# EAGLE design IRRemote (EAGLE 7.5.0)
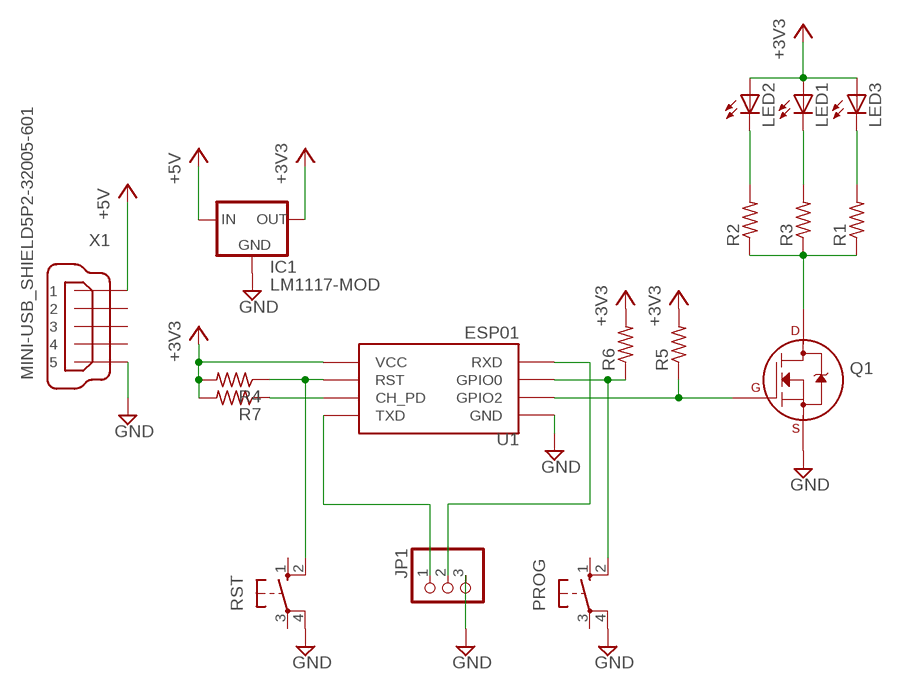
[diagram p0: schematic, sheet 1]

## Parts
IC1  LM1117-MOD  [TO220BV]
JP1  PINHD-1X3  [1X03]
LED1  LED5MM  [LED5MM]
LED2  LED5MM  [LED5MM]
LED3  LED5MM  [LED5MM]
PROG  10-XX  [B3F-10XX]
Q1  2N7000_TO92  [TO-92]
R1  R-US_0309/10  [0309/10]
R2  R-US_0309/10  [0309/10]
R3  R-US_0309/10  [0309/10]
R4  R-US_0309/10  [0309/10]
R5  R-US_0309/10  [0309/10]
R6  R-US_0309/10  [0309/10]
R7  R-US_0309/10  [0309/10]
RST  10-XX  [B3F-10XX]
U1  ESP01  [ESP01A]
X1  MINI-USB_SHIELD5P2-32005-601  [32005-601]

## Nets
+3V3: IC1.2(VOUT) LED1.A LED2.A LED3.A R4.2 R5.2 R6.2 R7.2 U1.VCC
+5V: IC1.3(VIN) X1.1
GND: IC1.1(GND) JP1.3 PROG.4(P1) Q1.1(S) RST.4(P1) U1.GND X1.5
N$1: Q1.3(D) R1.1 R2.1 R3.1
N$2: LED2.K(C) R2.2
N$3: LED1.K(C) R3.2
N$4: LED3.K(C) R1.2
N$5: Q1.2(G) R5.1 U1.GPIO2
N$8: R4.1 RST.2(S1) U1.RST
N$9: PROG.2(S1) R6.1 U1.GPIO0
N$11: R7.1 U1.CH_PD
RX: JP1.2 U1.RX(RXD)
TX: JP1.1 U1.TX(TXD)
Unconnected: PROG.1(S) PROG.3(P) RST.1(S) RST.3(P) X1.2 X1.3 X1.4 X1.M1(S1) X1.M2(S2)

## Library data of the parts
IC1 = bt_regulator:LM1117-MOD
JP1 = pinhead:PINHD-1X3: PIN HEADER
LED1-LED3 = led:LED: LED OSRAM: - CHIPLED LG R971, LG N971, LY N971, LG Q971, LY Q971, LO R971, LY R971 LH N974, LH R974 LS Q976, LO Q976, LY Q976 LO Q996 - Hyper CHIPLED LW Q18S LB Q993, LB Q99A, LB R99A - SideLED LS A670, LO A670, LY A670, LG A670, LP A670 LB A673, LV A673, LT A673, LW A673 LH A674 LY A675 LS A676, LA A676, LO A676, LY A676, LW A676 LS A679, LY A679, LG A679 - Hyper Micro SIDELED® LS Y876, LA Y876, LO Y876, LY Y876 LT Y87S - SmartLED LW L88C, LW L88S LB L89C, LB L89S, LG L890 LS L89K, LO L89K, LY L89K LS L896, LA L896, LO L896, LY L896 - TOPLED LS T670, LO T670, LY T670, LG T670, LP T670 LSG T670, LSP T670, LSY T670, LOP T670, LYG T670 LG T671, LOG T671, LSG T671 LB T673, LV T673, LT T673, LW T673 LH T674 LS T676, LA T676, LO T676, LY T676, LB T676, LH T676, LSB T676, LW T676 LB T67C, LV T67C, LT T67C, LS T67K, LO T67K, LY T67K, LW E67C LS E67B, LA E67B, LO E67B, LY E67B, LB E67C, LV E67C, LT E67C LW T67C LS T679, LY T679, LG T679 LS T770, LO T770, LY T770, LG T770, LP T770 LB T773, LV T773, LT T773, LW T773 LH T774 LS E675, LA E675, LY E675, LS T675 LS T776, LA T776, LO T776, LY T776, LB T776 LHGB T686 LT T68C, LB T68C - Hyper Mini TOPLED® LB M676 - Mini TOPLED Santana® LG M470 LS M47K, LO M47K, LY M47K Source: http://www.osram.convergy.de LUXEON: - LUMILED® LXK2-PW12-R00, LXK2-PW12-S00, LXK2-PW14-U00, LXK2-PW14-V00 LXK2-PM12-R00, LXK2-PM12-S00, LXK2-PM14-U00 LXK2-PE12-Q00, LXK2-PE12-R00, LXK2-PE12-S00, LXK2-PE14-T00, LXK2-PE14-U00 LXK2-PB12-K00, LXK2-PB12-L00, LXK2-PB12-M00, LXK2-PB14-N00, LXK2-PB14-P00, LXK2-PB14-Q00 LXK2-PR12-L00, LXK2-PR12-M00, LXK2-PR14-Q00, LXK2-PR14-R00 LXK2-PD12-Q00, LXK2-PD12-R00, LXK2-PD12-S00 LXK2-PH12-R00, LXK2-PH12-S00 LXK2-PL12-P00, LXK2-PL12-Q00, LXK2-PL12-R00 Source: www.luxeon.com KINGBRIGHT: KA-3528ASYC Source: www.kingbright.com
PROG RST = switch-omron:10-XX: OMRON SWITCH; MPN: B3F-1000; OC_FARNELL: 176432; OC_NEWARK: 36M3542
Q1 = transistors:2N700*: 2N7000, 2N7002, NDS7002A N-channel enhancement mode MOSFET
R1-R7 = resistor:R-US_: RESISTOR, American symbol
U1 = esp8266modules:ESP01: ESP8266 Wifi module 01
X1 = con-cypressindustries:MINI-USB_SHIELD5P2-: MINI USB-B R/A DIP 5pol. Source: www.cypressindustries.com; OC_FARNELL: unknown; OC_NEWARK: unknown

## Board
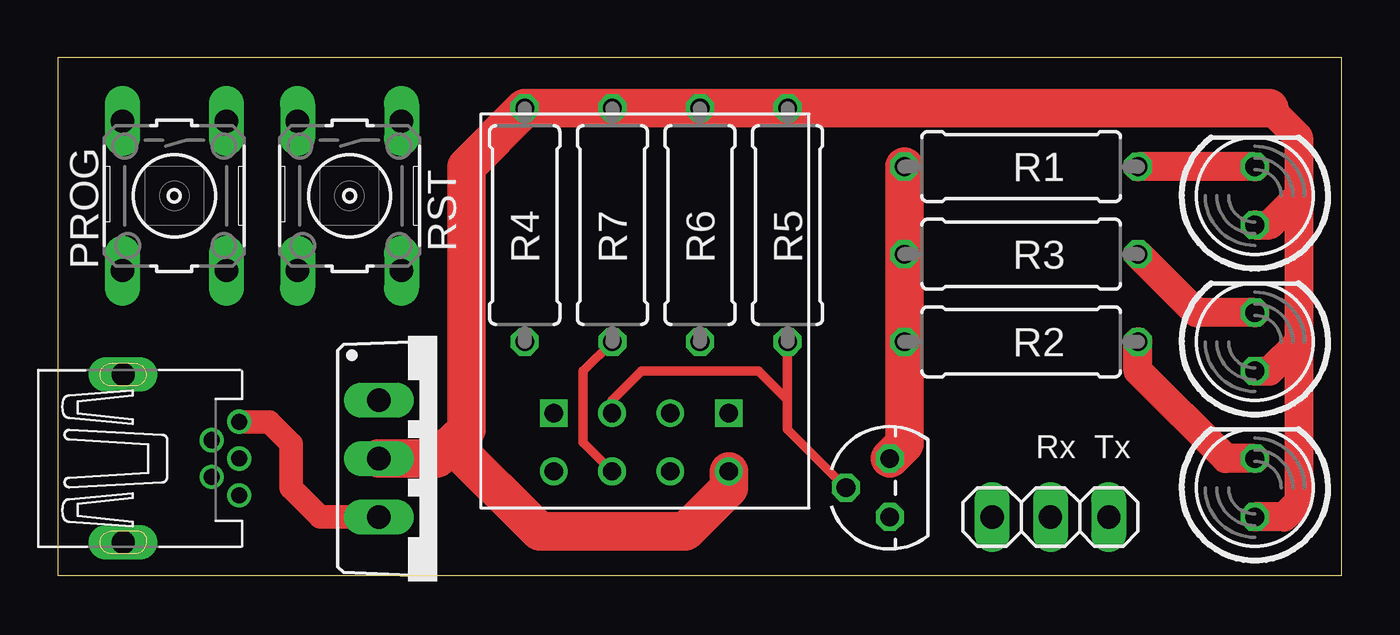
[diagram p1: board, top side]
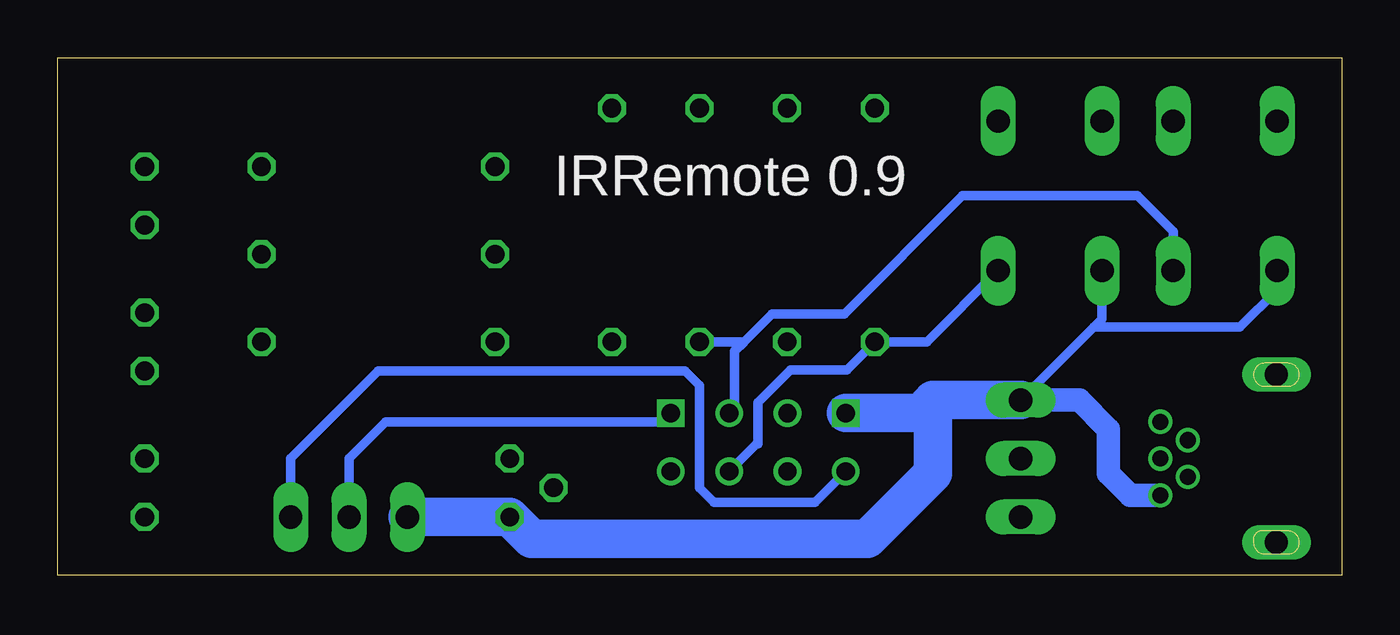
[diagram p2: board, bottom side, seen from below]

Size 55.86 x 22.53 mm. Coordinates in mm from the lower left corner, seen from the top.
Outline: 0,0 55.86,0 55.86,22.53 0,22.53 0,0
Copper layers (1*16): Top 0.0356mm / dielectric 1.5011mm / Bottom 0.0356mm
Design rules "LaenPCBOrder *": minimum track width 16mil, minimum drill 13mil, track to track 16mil, track to pad 10mil, pad to pad 6mil, via to via 6mil, smd to smd 6mil, copper to edge 15mil, drill to drill 6mil, minimum pad ring 7mil, minimum via ring 7mil, stop-mask expansion 3mil, vias tented up to drill 0mil, thermal gap 10mil

### Footprints (pad centres in the part's own frame; a part is rotated, then mirrored left to right if it is on the bottom)
TO220BV = drill 1.016 long: 1 -2.54,0; 2 0,0; 3 2.54,0
1X03 = drill 1.016 long: 1 -2.54,0; 2 0,0; 3 2.54,0
LED5MM = drill 0.813 octagon: A -1.27,0; K 1.27,0
B3F-10XX = drill 1.016 long: 1 -3.251,2.261; 2 3.251,2.261; 3 -3.251,-2.261; 4 3.251,-2.261
TO-92 = drill 0.813 octagon: 1 -1.27,0; 2 0,1.905; 3 1.27,0
0309/10 = drill 0.813 octagon: 1 -5.08,0; 2 5.08,0
ESP01A = drill 0.8: CH_PD -1.285,-6.907; GPIO0 1.255,-4.367; GPIO2 -1.285,-4.367; RST 1.255,-6.907; TX -3.825,-6.907; VCC 3.795,-6.907 | drill 0.8 square: GND -3.825,-4.367; RX 3.795,-4.367
32005-601 = drill 0.7 pad 1.016: 1 2.825,1.6; 2 1.625,0.8; 3 2.825,0; 4 1.625,-0.8; 5 2.825,-1.6 | drill 1 pad 1.422 long: M1 -2.225,3.65; M2 -2.225,-3.65

### Placement (x,y rotation side)
IC1  13.97,5.08 270 top
JP1  43.18,2.54 180 top
LED1  52.07,10.16 90 top
LED2  52.07,3.81 90 top
LED3  52.07,16.51 90 top
PROG  5.08,16.51 270 top
Q1  36.2,3.81 90 top
R1  41.91,17.78 0 top
R2  41.91,10.16 0 top
R3  41.91,13.97 0 top
R4  20.32,15.24 90 top
R5  31.75,15.24 90 top
R6  27.94,15.24 90 top
R7  24.13,15.24 90 top
RST  12.7,16.51 270 top
U1  25.4,11.43 0 top
X1  5.08,5.08 0 top

### Tracks (layer width: path | path; a pad name or v marks a point on that pad's centre or on a via)
+3V3
  Top 1.27: 52.7,20.32 53.98,19.05 53.98,16.51 | 53.98,16.51 53.98,10.16 | 53.98,10.16 53.98,3.17 53.34,2.54 LED2.A | LED1.A 52.7,8.89 53.98,10.16 | LED3.A 52.7,15.24 53.98,16.51
  Top 1.676: IC1.2 16.51,5.08 17.14,5.71 | 17.14,5.71 17.78,6.35 17.78,17.78 R4.2 R7.2 R6.2 R5.2 52.7,20.32 | 17.14,5.71 20.95,1.91 27.3,1.91 29.2,3.79 U1.VCC
+5V
  Top 1.016: IC1.3 11.43,2.54 10.16,3.81 10.16,5.71 9.2,6.68 X1.1
GND
  Bottom 0.406: RST.4 10.44,11.15 10.79,10.79 | 10.79,10.79 IC1.1 | PROG.4 2.82,12.42 4.45,10.79 10.79,10.79
  Bottom 1.016: IC1.1 11.43,7.62 10.16,6.35 10.16,4.45 9.2,3.48 X1.5
  Bottom 1.676: IC1.1 17.78,7.62 | 17.78,7.62 18.34,7.06 U1.GND | 17.78,7.62 17.78,4.45 20.64,1.59 35.24,1.59 Q1.1 JP1.3
N$1
  Top 1.676: R1.1 R3.1 R2.1 36.83,5.71 Q1.3
N$2
  Top 1.27: LED2.K 50.8,5.08 46.99,8.89 R2.2
N$3
  Top 1.27: LED1.K 49.53,11.43 R3.2
N$4
  Top 1.27: LED3.K R1.2
N$5
  Top 0.406: R5.1 31.75,7.62 | 31.75,7.62 30.48,8.89 25.4,8.89 24.11,7.61 U1.GPIO2 | 31.75,7.62 31.75,6.35 Q1.2
N$8
  Bottom 0.406: RST.2 18.06,10.16 R4.1 21.54,8.94 23.98,8.94 25.4,7.52 25.4,5.71 25.46,5.71 U1.RST
N$9
  Bottom 0.406: 26.01,10.16 26.42,9.75 26.42,7.3 U1.GPIO0 | PROG.2 7.34,14.96 8.89,16.51 16.51,16.51 21.64,11.38 24.79,11.38 26.01,10.16 | R6.1 26.01,10.16
N$11
  Top 0.406: U1.CH_PD 22.86,5.78 22.86,8.89 R7.1
RX
  Bottom 0.406: JP1.2 43.18,5.08 41.59,6.67 29.59,6.67 U1.RX
TX
  Bottom 0.406: U1.TX 22.92,3.17 27.3,3.17 27.94,3.81 27.94,8.26 28.57,8.89 41.91,8.89 45.72,5.08 JP1.1

### Text on the board
tPlace: Rx | Tx
bPlace: IRRemote 0.9